# Altium project Major Buzz Kill.PrjPCB (part 4 of 4)
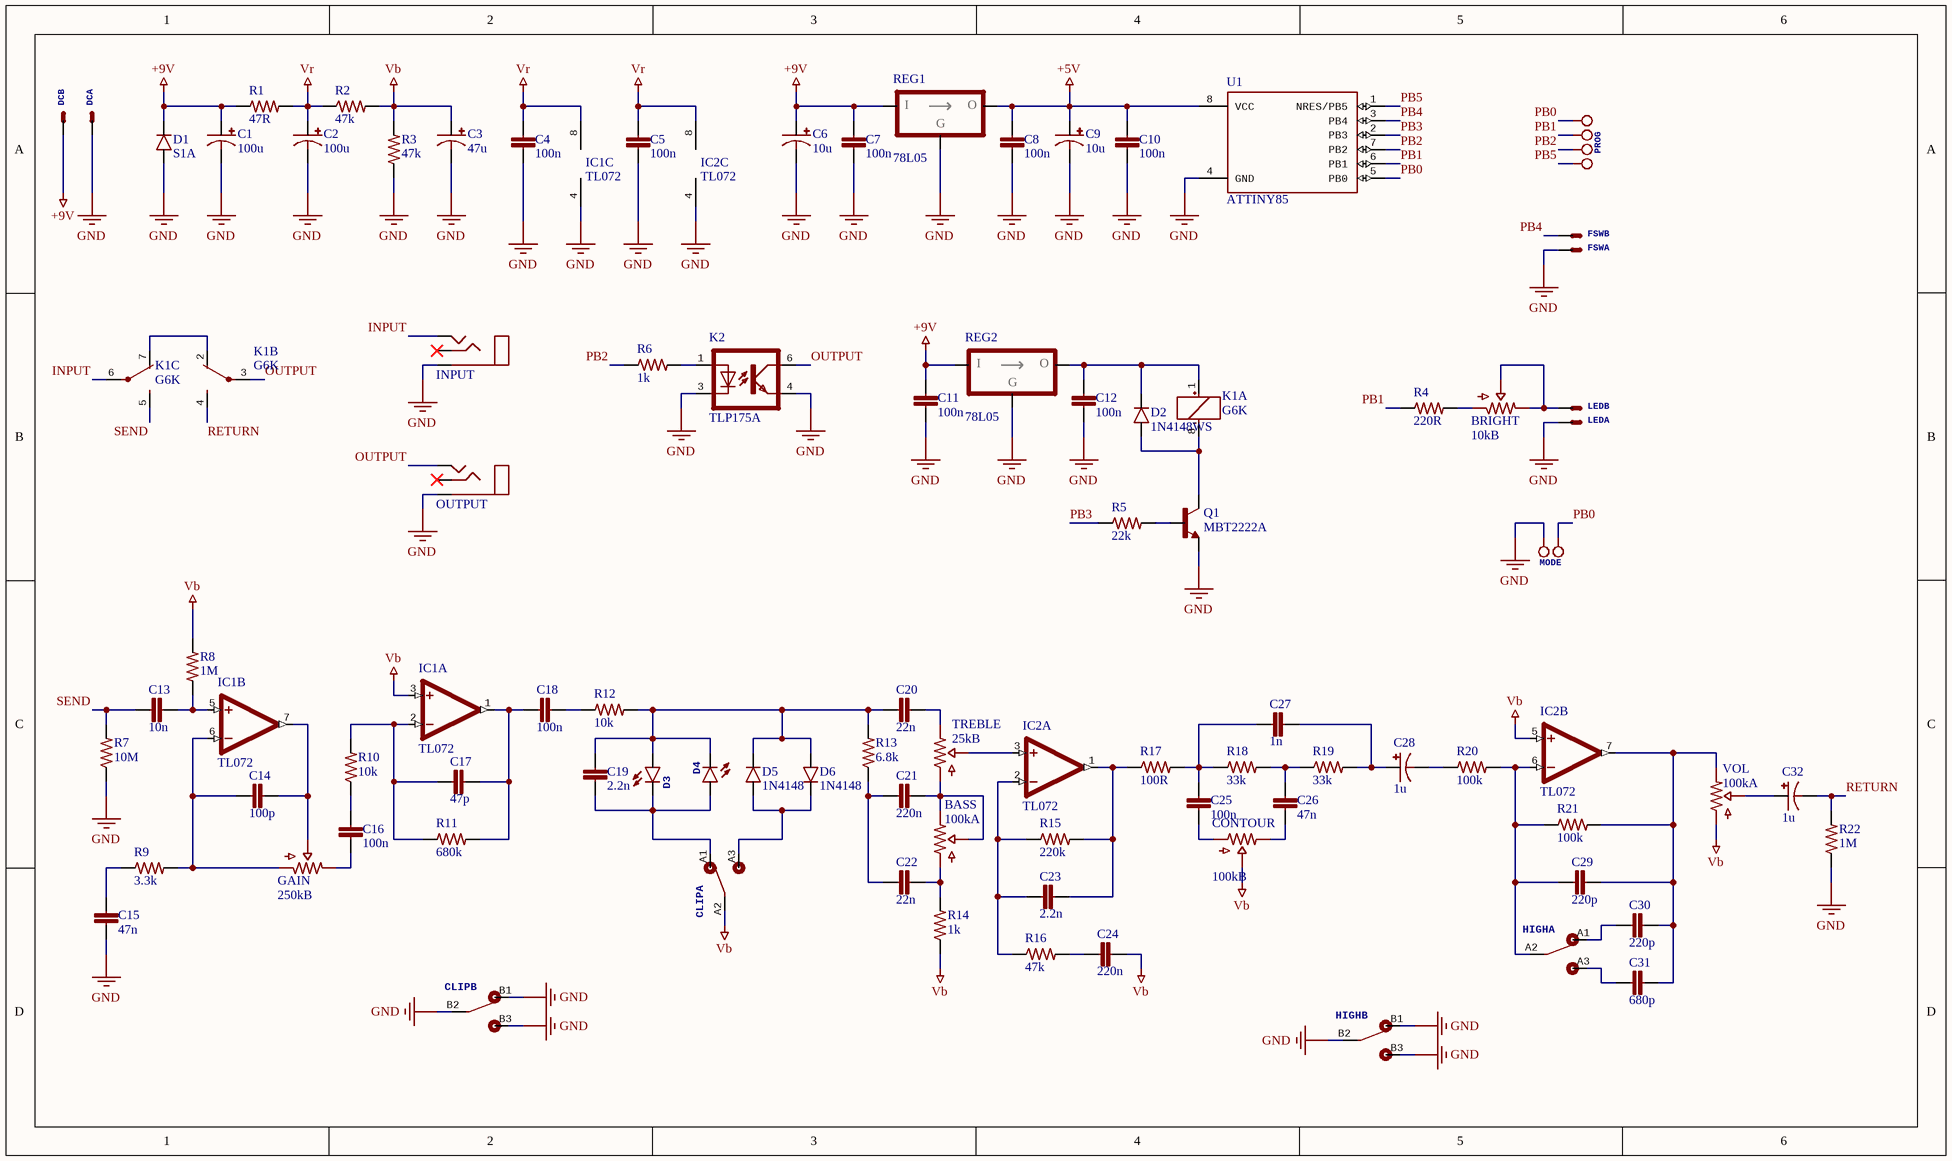
[diagram p3: Major Buzz Kill.SchDoc]

## Sheet Major Buzz Kill.SchDoc (continued)

### Library data of the parts (continued)
U1 = ATTINY85-20SU: IC, 8BIT MCU, AVR TINY, 20MHZ, 8-SOIC; Manufacturer: Microchip / Atmel; Memory Type: FLASH; Memory Size: 8KB; Number of Timers/Counters: 2; RAM Size: 512B; Interface: SPI; Max Supply Voltage: 5.5V; Min Supply Voltage: 2.7V; Number of I/Os: 6; Oscillator Type: Internal; Peripherals: Brown-out Detect/Reset; Data Bus Width: 8b; Watchdog Timer: Yes; Number of ADC Channels: 4; Number of UART Channels: 1; Access Time: 20us; Supplier 1: Farnell; Supplier Part Number 1: 1455164; Manufacturer Part Number: ATTINY85-20SU; Stock: 2172; Pricing: 1=0.972, 25=0.925, 100=0.894, 1000=0.862 (EUR); RoHS: Yes; Mount: Surface Mount; Case/Package: SOIC; Number of Pins: 8; Contact Plating: Tin; Min Operating Temperature: -40°C; Max Operating Temperature: 85°C; Frequency: 20MHz; Packaging: Rail/Tube; Core Architecture: AVR; Package Quantity: 95; Number of Programmable I/O: 6; Max Frequency: 20MHz; Number of PWM Channels: 6; Density: 8KB; Number of SPI Channels: 1; Number of I2C Channels: 1; Termination: SMD/SMT; Length: 5.35mm; Height: 1.91mm; Width: 5.4mm; Radiation Hardening: No; Lead Free: Lead Free; REACH SVHC: No SVHC; ComponentLink1URL: https://datasheet.ciiva.com/1167/1698186-1167152.pdf?src-supplier=Newark; ComponentLink1Description: https://datasheet.ciiva.com/1167/1698186-1167152.pdf?src-supplier=Newark; ComponentLink2URL: https://datasheet.ciiva.com/15122/getdatasheetpartid-131914-15122511.pdf?src-supplier=Verical; ComponentLink2Description: https://datasheet.ciiva.com/15122/getdatasheetpartid-131914-15122511.pdf?src-supplier=Verical; ComponentLink3URL: https://datasheet.ciiva.com/26207/doc2586-26207573.pdf?src-supplier=Avnet+Europe; ComponentLink3Description: https://datasheet.ciiva.com/26207/doc2586-26207573.pdf?src-supplier=Avnet+Europe; ComponentLink4URL: https://datasheet.ciiva.com/28653/1698186-28653829.pdf?src-supplier=Element14; ComponentLink4Description: https://datasheet.ciiva.com/28653/1698186-28653829.pdf?src-supplier=Element14; ComponentLink5URL: https://datasheet.ciiva.com/3203/doc2586-3203150.pdf?src-supplier=Avnet; ComponentLink5Description: https://datasheet.ciiva.com/3203/doc2586-3203150.pdf?src-supplier=Avnet; Price: 0.98

### Notes on the sheet
- (in symbol TS78L05CXRFG) I; O; G